# Altium schematic sheet Kingst51开发板原理图.SchDoc: STM32F107 Core Board
size 467 x 264 mm; Organization: Kingst; DocumentNumber: CB3201; Revision: 1.00.00; SheetNumber: 1; SheetTotal: 1; PageSetup: Record=PageOptions|CenterHorizontal=True|CenterVertical=True|PrintScale=0.85|XCorrection=1.00|YCorrection=1.00|PrintKind=2|BorderSize=5000000|LeftOffset=0|BottomOffset=0|Orientation=2|PaperLength=4200|PaperWidth=2970|Scale=100|PaperSource=15|PrintQuality=300|MediaType=1|DitherType=10|PaperKind=A3|PrintScaleMode=1
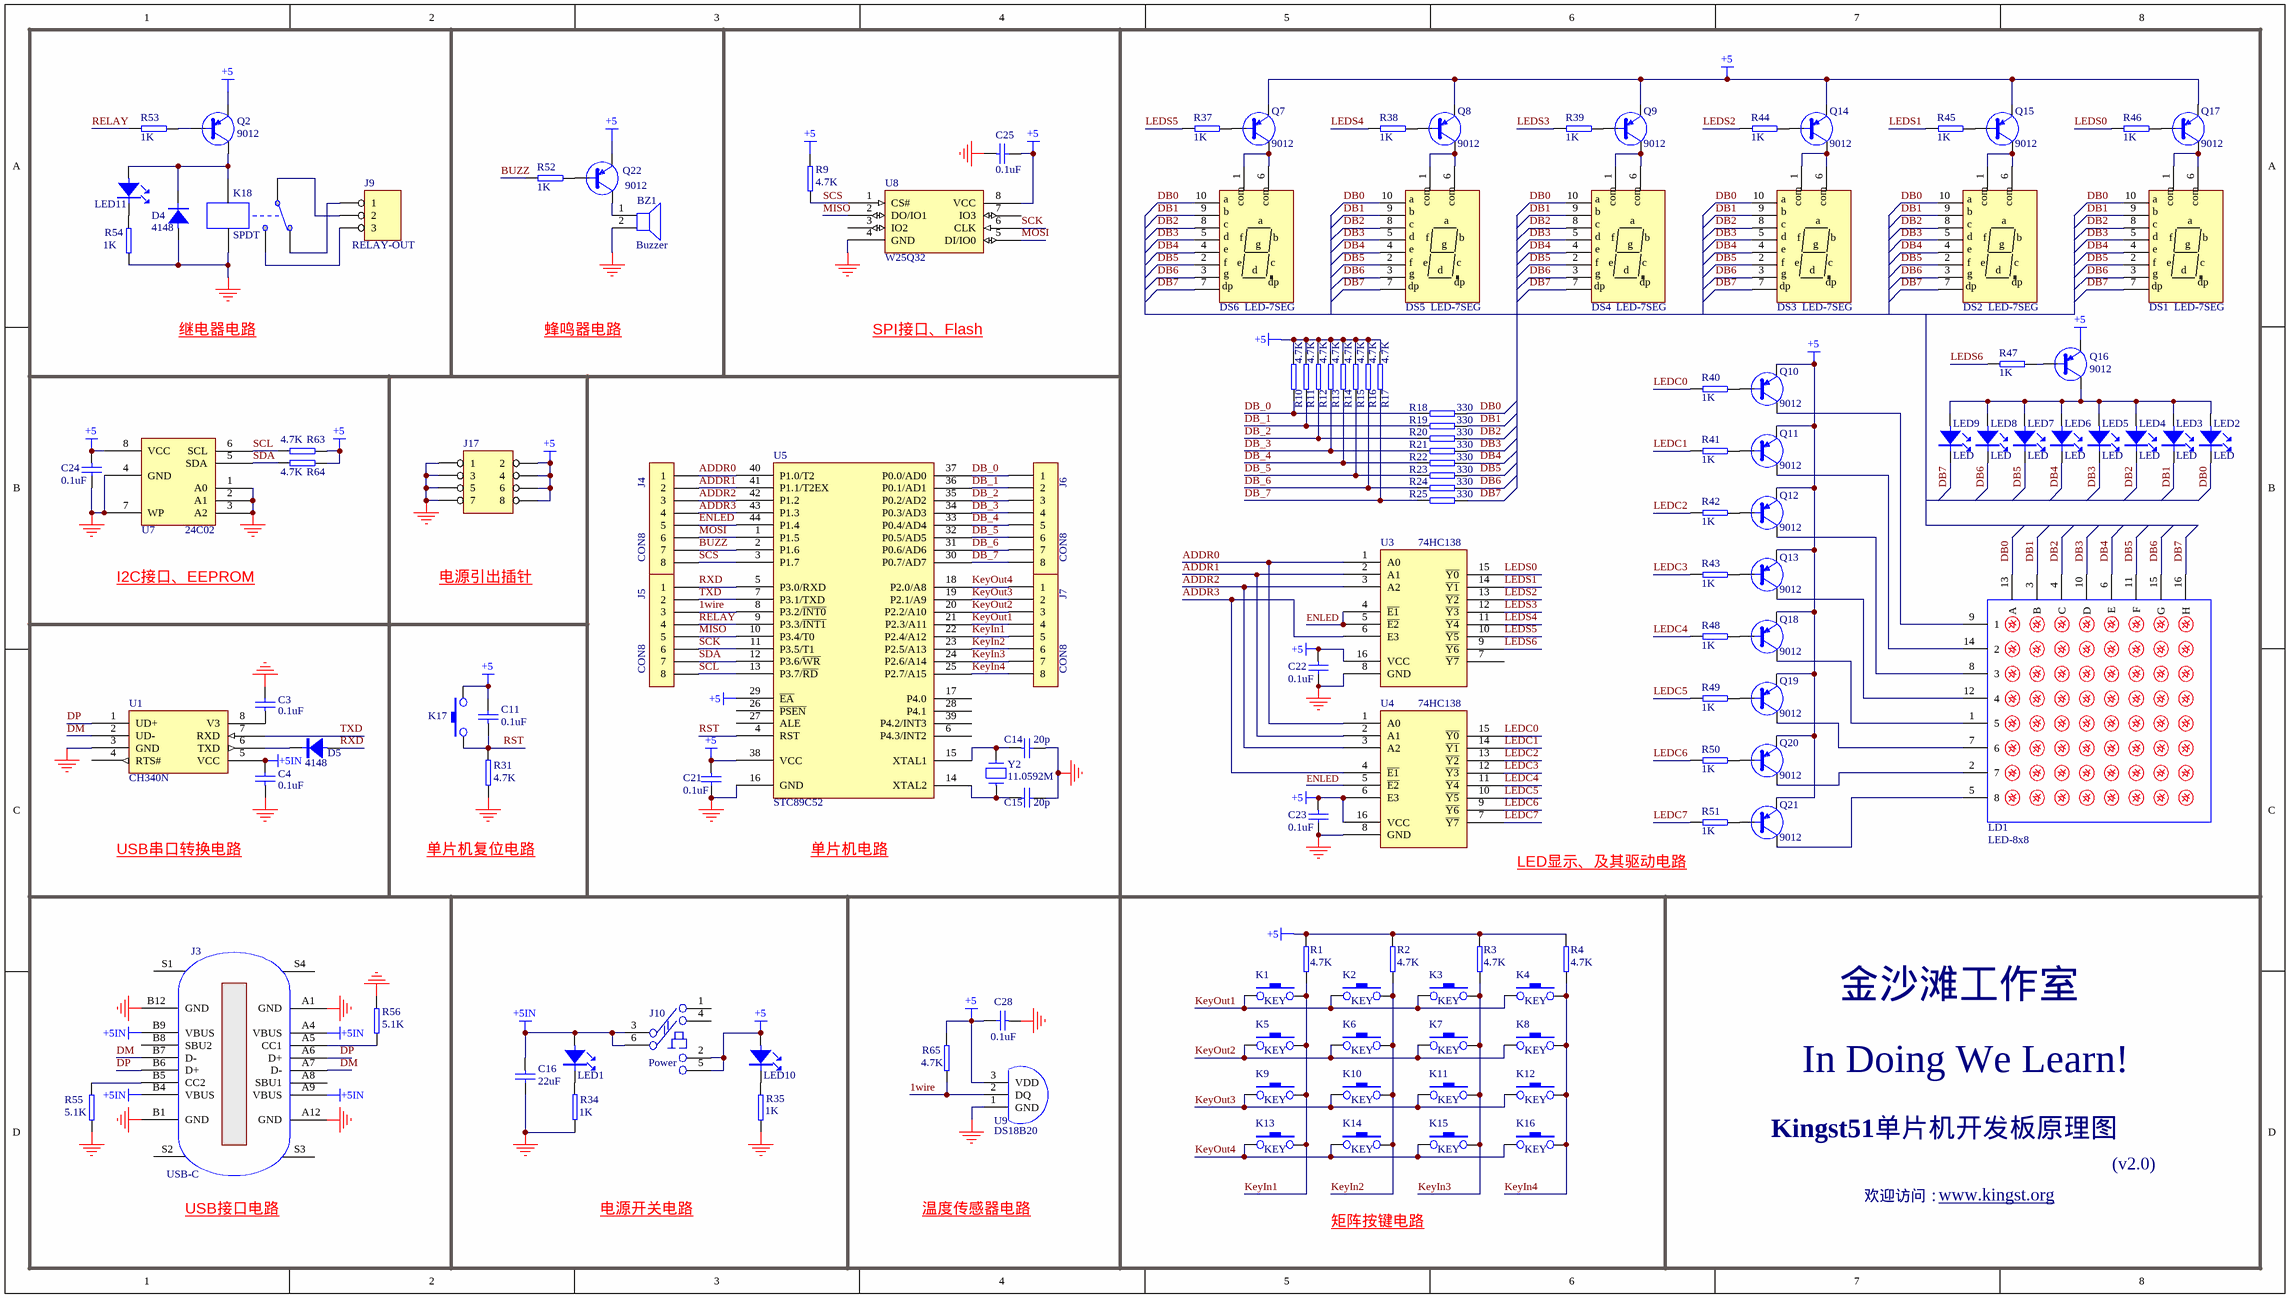
[diagram p0: Kingst51开发板原理图.SchDoc]

## Parts
BZ1  Buzzer  [BUZZ-D12]
C3  0.1uF  [0603C]
C4  0.1uF  [0603C]
C11  0.1uF  [0603C]
C14  20p  [0603C]
C15  20p  [0603C]
C16  22uF  [0805C]
C21  0.1uF  [0603C]
C22  0.1uF  [0603C]
C23  0.1uF  [0603C]
C24  0.1uF  [0603C]
C25  0.1uF  [0603C]
C28  0.1uF  [0603C]
D4  4148  [SOD-123]
D5  4148  [SOD-123]
DS1  LED-7SEG  [LED-C7]
DS2  LED-7SEG  [LED-C7]
DS3  LED-7SEG  [LED-C7]
DS4  LED-7SEG  [LED-C7]
DS5  LED-7SEG  [LED-C7]
DS6  LED-7SEG  [LED-C7]
J3  USB-C  [USB-C-16P]
J4  CON8  [SIP8]
J5  CON8  [SIP8]
J6  CON8  [SIP8]
J7  CON8  [SIP8]
J9  RELAY-OUT  [P5.08-3P]
J10  Power
J17  CON4X2  [IDC4X2-M]  (value not drawn)
K1  KEY  [KEY-6X6]
K2  KEY  [KEY-6X6]
K3  KEY  [KEY-6X6]
K4  KEY  [KEY-6X6]
K5  KEY  [KEY-6X6]
K6  KEY  [KEY-6X6]
K7  KEY  [KEY-6X6]
K8  KEY  [KEY-6X6]
K9  KEY  [KEY-6X6]
K10  KEY  [KEY-6X6]
K11  KEY  [KEY-6X6]
K12  KEY  [KEY-6X6]
K13  KEY  [KEY-6X6]
K14  KEY  [KEY-6X6]
K15  KEY  [KEY-6X6]
K16  KEY  [KEY-6X6]
K17  RESET  [KEY-6X6]  (value not drawn)
K18  SPDT  [RELAY-SPDT]
LD1  LED-8x8  [LED-8*8]
LED1  LED  [0805LD]  (value not drawn)
LED2  LED  [0805LD]
LED3  LED  [0805LD]
LED4  LED  [0805LD]
LED5  LED  [0805LD]
LED6  LED  [0805LD]
LED7  LED  [0805LD]
LED8  LED  [0805LD]
LED9  LED  [0805LD]
LED10  LED  [0805LD]  (value not drawn)
LED11  LED  [0805LD]  (value not drawn)
Q2  9012  [SOT-23-Q]
Q7  9012  [SOT-23-Q]
Q8  9012  [SOT-23-Q]
Q9  9012  [SOT-23-Q]
Q10  9012  [SOT-23-Q]
Q11  9012  [SOT-23-Q]
Q12  9012  [SOT-23-Q]
Q13  9012  [SOT-23-Q]
Q14  9012  [SOT-23-Q]
Q15  9012  [SOT-23-Q]
Q16  9012  [SOT-23-Q]
Q17  9012  [SOT-23-Q]
Q18  9012  [SOT-23-Q]
Q19  9012  [SOT-23-Q]
Q20  9012  [SOT-23-Q]
Q21  9012  [SOT-23-Q]
Q22  9012  [SOT-23-Q]
R1  4.7K  [0603R]
R2  4.7K  [0603R]
R3  4.7K  [0603R]
R4  4.7K  [0603R]
R9  4.7K  [0603R]
R10  4.7K  [0603R]
R11  4.7K  [0603R]
R12  4.7K  [0603R]
R13  4.7K  [0603R]
R14  4.7K  [0603R]
R15  4.7K  [0603R]
R16  4.7K  [0603R]
R17  4.7K  [0603R]
R18  330  [0603R]
R19  330  [0603R]
R20  330  [0603R]
R21  330  [0603R]
R22  330  [0603R]
R23  330  [0603R]
R24  330  [0603R]
R25  330  [0603R]
R31  4.7K  [0603R]
R34  1K  [0603R]
R35  1K  [0603R]
R37  1K  [0603R]
R38  1K  [0603R]
R39  1K  [0603R]
R40  1K  [0603R]
R41  1K  [0603R]
R42  1K  [0603R]
R43  1K  [0603R]
R44  1K  [0603R]
R45  1K  [0603R]
R46  1K  [0603R]
R47  1K  [0603R]
R48  1K  [0603R]
R49  1K  [0603R]
R50  1K  [0603R]
R51  1K  [0603R]
R52  1K  [0603R]
R53  1K  [0603R]
R54  1K  [0603R]
R55  5.1K  [0603R]
R56  5.1K  [0603R]
R63  4.7K  [0603R]
R64  4.7K  [0603R]
R65  4.7K  [0603R]
U1  CH340N  [SOP-8_3.9]
U3  74HC138  [SOP-16_3.9]
U4  74HC138  [SOP-16_3.9]
U5  STC89C52  [LQFP44_0.8]
U7  24C02  [SOP-8_3.9]
U8  W25Q32  [SOP-8_5.3]
U9  DS18B20  [TO-92]
Y2  11.0592M  [SMD-3225-4P]

## Nets
+5: C11.2 C21.1 C22.1 C23.1 C24.1 C25.2 C28.2 J10.2 J10.5 J17.2 J17.4 J17.6 J17.8 K17.2 LED10.A Q2.E Q7.E Q8.E Q9.E Q10.E Q11.E Q12.E Q13.E Q14.E Q15.E Q16.E Q17.E Q18.E Q19.E Q20.E Q21.E Q22.E R1.2 R2.2 R3.2 R4.2 R9.2 R10.2 R11.2 R12.2 R13.2 R14.2 R15.2 R16.2 R17.2 R63.2 R64.2 R65.2 U3.16(VCC) U4.6(E3) U4.16(VCC) U5.29(~{EA}) U5.38(VCC) U7.8(VCC) U8.8(VCC) U9.3(VDD)
+5IN: C4.2 C16.1 J3.A4(VBUS) J3.A9(VBUS) J3.B4(VBUS) J3.B9(VBUS) J10.3 J10.6 LED1.A U1.5(VCC)
GND: BZ1.2 C3.2 C4.1 C14.2 C15.2 C16.2 C21.2 C22.2 C23.2 C24.2 C25.1 C28.1 D4.A J3.A1(GND) J3.A12(GND) J3.B1(GND) J3.B12(GND) J17.1 J17.3 J17.5 J17.7 K18.C2 R31.2 R34.2 R35.1 R54.1 R55.1 R56.2 U1.3(GND) U3.8(GND) U4.8(GND) U5.16(GND) U7.1(A0) U7.2(A1) U7.3(A2) U7.4(GND) U7.7(WP) U8.4(GND) U9.1(GND)
1wire: J5.3 R65.1 U5.8(P3.2/~{INT0}) U9.2(DQ)
ADDR0: J4.1 U3.1(A0) U4.1(A0) U5.40(P1.0/T2)
ADDR1: J4.2 U3.2(A1) U4.2(A1) U5.41(P1.1/T2EX)
ADDR2: J4.3 U3.3(A2) U4.3(A2) U5.42(P1.2)
ADDR3: J4.4 U3.6(E3) U4.4(~{E1}) U5.43(P1.3)
BUZZ: J4.7 R52.1 U5.2(P1.6)
DB0: DS1.10(a) DS2.10(a) DS3.10(a) DS4.10(a) DS5.10(a) DS6.10(a) LD1.13(A) LED2.K R18.1
DB1: DS1.9(b) DS2.9(b) DS3.9(b) DS4.9(b) DS5.9(b) DS6.9(b) LD1.3(B) LED3.K R19.1
DB2: DS1.8(c) DS2.8(c) DS3.8(c) DS4.8(c) DS5.8(c) DS6.8(c) LD1.4(C) LED4.K R20.1
DB3: DS1.5(d) DS2.5(d) DS3.5(d) DS4.5(d) DS5.5(d) DS6.5(d) LD1.10(D) LED5.K R21.1
DB4: DS1.4(e) DS2.4(e) DS3.4(e) DS4.4(e) DS5.4(e) DS6.4(e) LD1.6(E) LED6.K R22.1
DB5: DS1.2(f) DS2.2(f) DS3.2(f) DS4.2(f) DS5.2(f) DS6.2(f) LD1.11(F) LED7.K R23.1
DB6: DS1.3(g) DS2.3(g) DS3.3(g) DS4.3(g) DS5.3(g) DS6.3(g) LD1.15(G) LED8.K R24.1
DB7: DS1.7(dp) DS2.7(dp) DS3.7(dp) DS4.7(dp) DS5.7(dp) DS6.7(dp) LD1.16(H) LED9.K R25.1
DB_0: J6.1 R10.1 R18.2 U5.37(P0.0/AD0)
DB_1: J6.2 R11.1 R19.2 U5.36(P0.1/AD1)
DB_2: J6.3 R12.1 R20.2 U5.35(P0.2/AD2)
DB_3: J6.4 R13.1 R21.2 U5.34(P0.3/AD3)
DB_4: J6.5 R14.1 R22.2 U5.33(P0.4/AD4)
DB_5: J6.6 R15.1 R23.2 U5.32(P0.5/AD5)
DB_6: J6.7 R16.1 R24.2 U5.31(P0.6/AD6)
DB_7: J6.8 R17.1 R25.2 U5.30(P0.7/AD7)
DM: J3.A7(D-) J3.B7(D-) U1.2(UD-)
DP: J3.A6(D+) J3.B6(D+) U1.1(UD+)
ENLED: J4.5 U3.4(~{E1}) U3.5(~{E2}) U4.5(~{E2}) U5.44(P1.4)
KeyIn1: J7.5 K1.1 K5.1 K9.1 K13.1 R1.1 U5.22(P2.4/A12)
KeyIn2: J7.6 K2.1 K6.1 K10.1 K14.1 R2.1 U5.23(P2.5/A13)
KeyIn3: J7.7 K3.1 K7.1 K11.1 K15.1 R3.1 U5.24(P2.6/A14)
KeyIn4: J7.8 K4.1 K8.1 K12.1 K16.1 R4.1 U5.25(P2.7/A15)
KeyOut1: J7.4 K1.2 K2.2 K3.2 K4.2 U5.21(P2.3/A11)
KeyOut2: J7.3 K5.2 K6.2 K7.2 K8.2 U5.20(P2.2/A10)
KeyOut3: J7.2 K9.2 K10.2 K11.2 K12.2 U5.19(P2.1/A9)
KeyOut4: J7.1 K13.2 K14.2 K15.2 K16.2 U5.18(P2.0/A8)
LEDC0: R40.1 U4.15(~{Y0})
LEDC1: R41.1 U4.14(~{Y1})
LEDC2: R42.1 U4.13(~{Y2})
LEDC3: R43.1 U4.12(~{Y3})
LEDC4: R48.1 U4.11(~{Y4})
LEDC5: R49.1 U4.10(~{Y5})
LEDC6: R50.1 U4.9(~{Y6})
LEDC7: R51.1 U4.7(~{Y7})
LEDS0: R46.1 U3.15(~{Y0})
LEDS1: R45.1 U3.14(~{Y1})
LEDS2: R44.1 U3.13(~{Y2})
LEDS3: R39.1 U3.12(~{Y3})
LEDS4: R38.1 U3.11(~{Y4})
LEDS5: R37.1 U3.10(~{Y5})
LEDS6: R47.2 U3.9(~{Y6})
MISO: J5.5 U5.10(P3.4/T0) U8.2(DO/IO1)
MOSI: J4.6 U5.1(P1.5) U8.5(DI/IO0)
RELAY: J5.4 R53.1 U5.9(P3.3/~{INT1})
RST: C11.1 K17.1 R31.1 U5.4(RST)
RXD: D5.A J5.1 U5.5(P3.0/RXD)
SCK: J5.6 U5.11(P3.5/T1) U8.6(CLK)
SCL: J5.8 R63.1 U5.13(P3.7/~{RD}) U7.6(SCL)
SCS: J4.8 R9.1 U5.3(P1.7) U8.1(CS#)
SDA: J5.7 R64.1 U5.12(P3.6/~{WR}) U7.5(SDA)
TXD: J5.2 U1.7(RXD) U5.7(P3.1/TXD)
NetBZ1_1: BZ1.1 Q22.C
NetC3_1: C3.1 U1.8(V3)
NetC14_1: C14.1 U5.15(XTAL1) Y2.3
NetC15_1: C15.1 U5.14(XTAL2) Y2.1
NetD4_K: D4.K K18.C1 LED11.A Q2.C
NetD5_K: D5.K U1.6(TXD)
NetDS1_1: DS1.1(com) DS1.6(com) Q17.C
NetDS2_1: DS2.1(com) DS2.6(com) Q15.C
NetDS3_1: DS3.1(com) DS3.6(com) Q14.C
NetDS4_1: DS4.1(com) DS4.6(com) Q9.C
NetDS5_1: DS5.1(com) DS5.6(com) Q8.C
NetDS6_1: DS6.1(com) DS6.6(com) Q7.C
NetJ3_A5: J3.A5(CC1) R56.1
NetJ3_B5: J3.B5(CC2) R55.2
NetJ9_1: J9.1 K18.NC
NetJ9_2: J9.2 K18.COM
NetJ9_3: J9.3 K18.NO
NetLD1_1: LD1.1(5) Q18.C
NetLD1_2: LD1.2(7) Q20.C
NetLD1_5: LD1.5(8) Q21.C
NetLD1_7: LD1.7(6) Q19.C
NetLD1_8: LD1.8(3) Q12.C
NetLD1_9: LD1.9(1) Q10.C
NetLD1_12: LD1.12(4) Q13.C
NetLD1_14: LD1.14(2) Q11.C
NetLED1_K: LED1.K R34.1
NetLED2_A: LED2.A LED3.A LED4.A LED5.A LED6.A LED7.A LED8.A LED9.A Q16.C
NetLED10_K: LED10.K R35.2
NetLED11_K: LED11.K R54.2
NetQ2_B: Q2.B R53.2
NetQ7_B: Q7.B R37.2
NetQ8_B: Q8.B R38.2
NetQ9_B: Q9.B R39.2
NetQ10_B: Q10.B R40.2
NetQ11_B: Q11.B R41.2
NetQ12_B: Q12.B R42.2
NetQ13_B: Q13.B R43.2
NetQ14_B: Q14.B R44.2
NetQ15_B: Q15.B R45.2
NetQ16_B: Q16.B R47.1
NetQ17_B: Q17.B R46.2
NetQ18_B: Q18.B R48.2
NetQ19_B: Q19.B R49.2
NetQ20_B: Q20.B R50.2
NetQ21_B: Q21.B R51.2
NetQ22_B: Q22.B R52.2

Not connected (* = marked no-connect by the designer): J3 A8(SBU1) B8(SBU2) S1(SH) S2(SH) S3(SH) S4(SH); J10 1 4; U1 4(RTS#); U3 7(~{Y7}); U5 6(P4.3/INT2) 17(P4.0) 26(~{PSEN}) 27(ALE) 28(P4.1) 39(P4.2/INT3); U8 3(IO2) 7(IO3)

## Notes on the sheet
- 继电器电路
- 蜂鸣器电路
- SPI接口、Flash
- I2C接口、EEPROM
- 电源引出插针
- USB串口转换电路
- 单片机复位电路
- 单片机电路
- LED显示、及其驱动电路
- 金沙滩工作室
- In Doing We Learn!
- Kingst51单片机开发板原理图
- (v2.0)
- (near J3) USB接口电路
- 电源开关电路
- 温度传感器电路
- 矩阵按键电路
- 欢迎访问：
- www.kingst.org

## Library data of the parts
BZ1 = SPEAKER
C3 C4 C11 C14-C16 C21-C25 C28 = CAP
D4 D5 = DIODE
DS1-DS6 = LED-7SEG: Seven-Segment Display, Right Hand Decimal
J3 = USB-C-16P: USB Type-C 16P 型插座
J4-J7 = CON8: Connector
J9 = CON3: Connector 3p
J10 = KEY-SL: Self-locking button
J17 = CON4X2: Connector 4*2p
K17 = KEY
K18 = RELAY-SPDT
LD1 = LED-8*8
Q2 Q7-Q22 = 2N-PNP
R1-R4 R9-R25 R31 R34 R35 R37-R56 R63-R65 = RES2
U1 = CH340N: USB to UART Bridge Controller
U3 U4 = 74XX138
U5 = STC89C52-44P: STC89C52 LQFP44
U7 = 24C01
U8 = W25Q128: SPI Serial Flash
Y2 = CRYSTAL